# EAGLE schematic maho-dio (EAGLE 4.16)

## Sheet 1 of 2
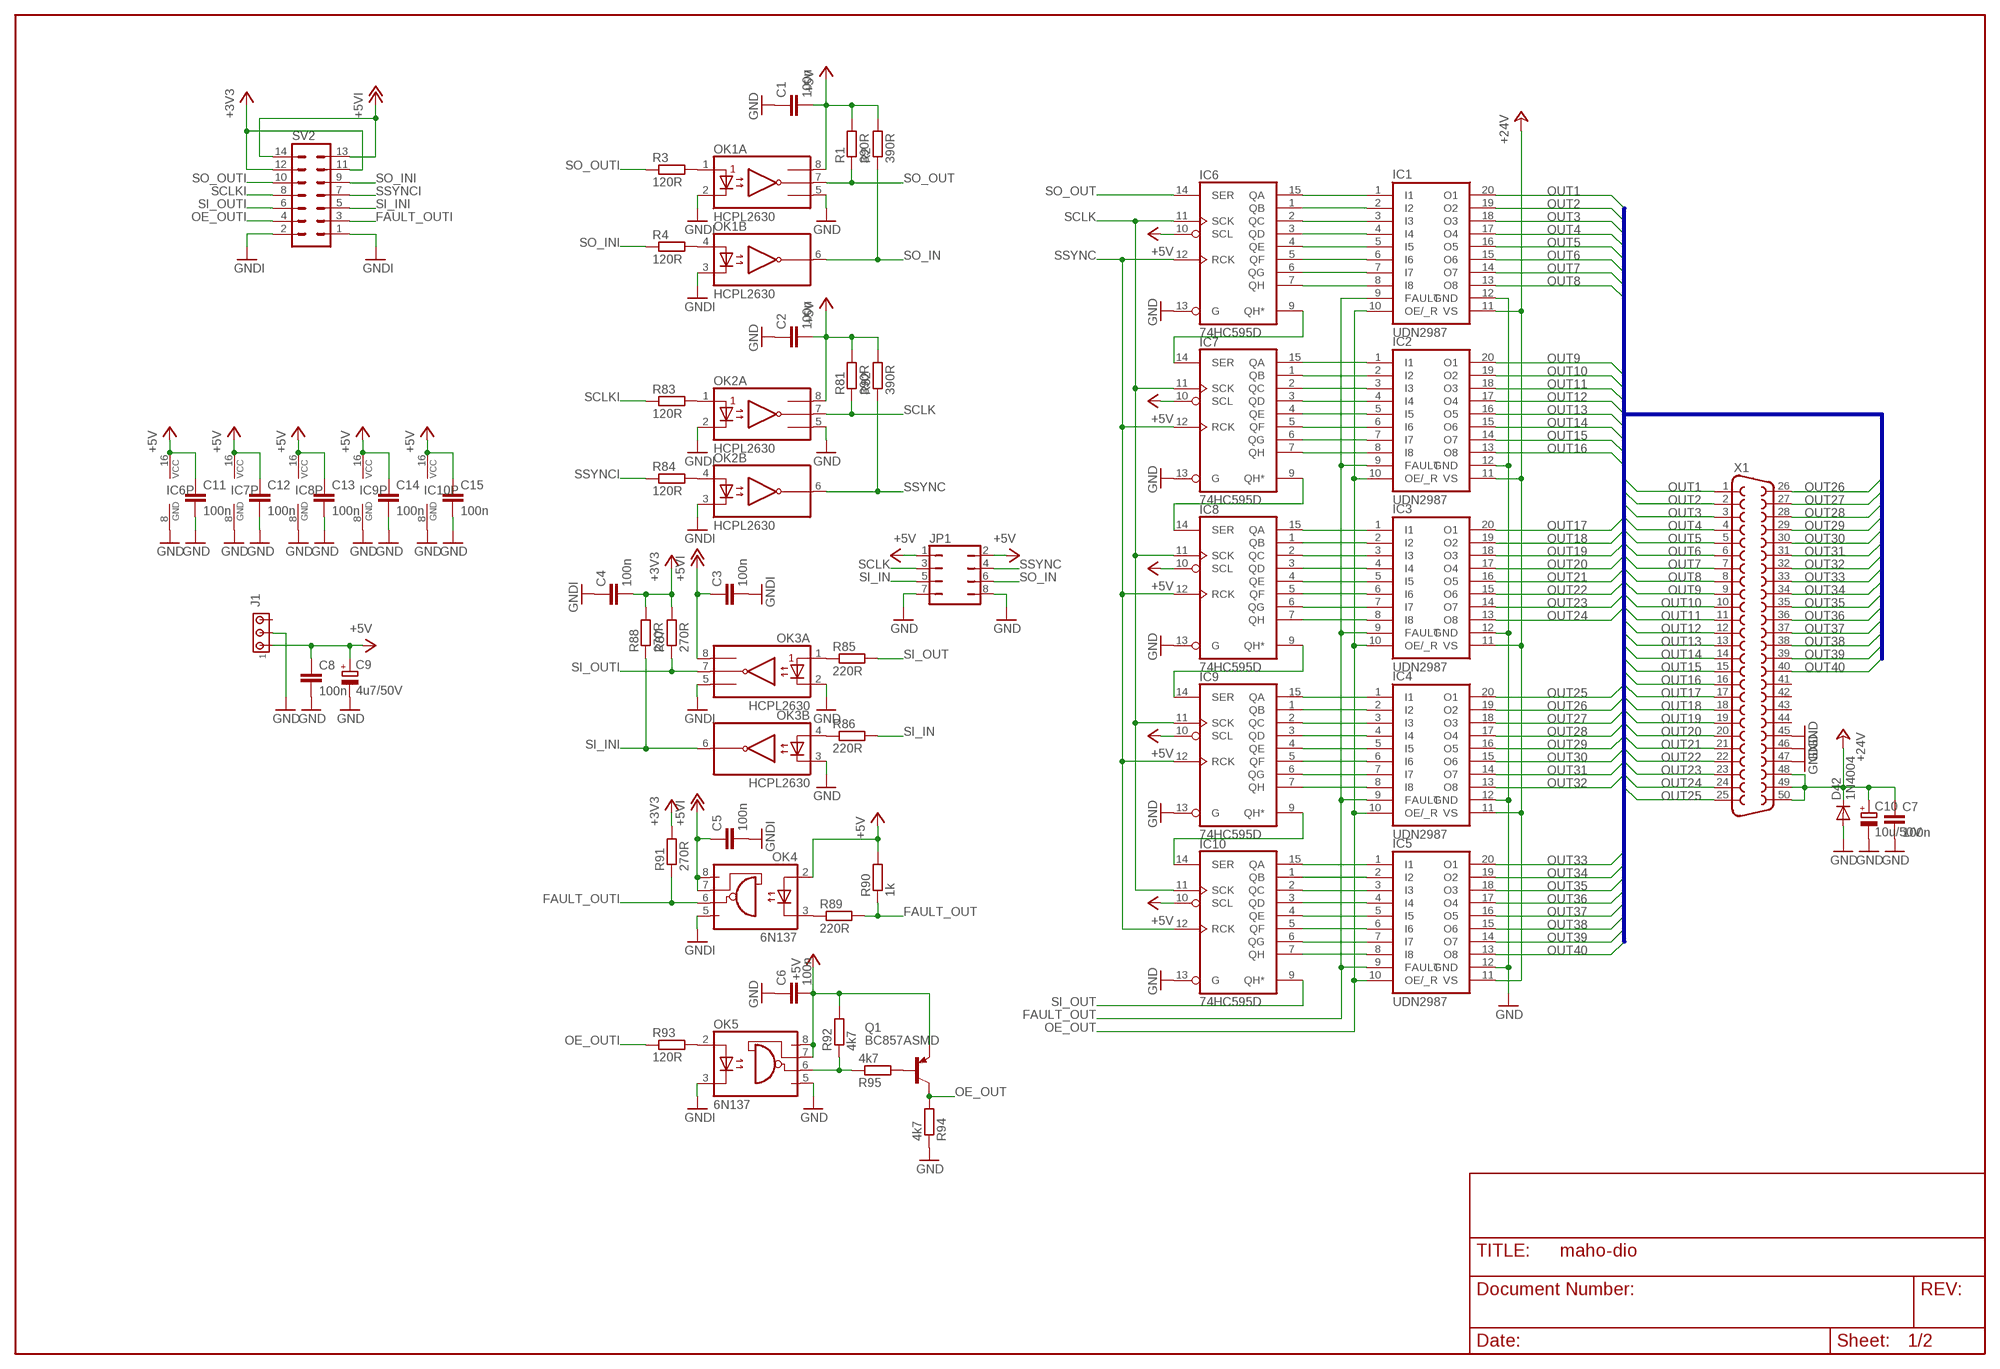
[diagram p0: schematic, sheet 1]

### Parts
C1  100n  C-EUC0603  [C0603]
C2  100n  C-EUC0603  [C0603]
C3  100n  C-EUC0603  [C0603]
C4  100n  C-EUC0603  [C0603]
C5  100n  C-EUC0603  [C0603]
C6  100n  C-EUC0603  [C0603]
C7  100n  C-EUC0603  [C0603]
C8  100n  C-EUC0603  [C0603]
C9  4u7/50V  CPOL-EUE2.5-5  [E2,5-5]
C10  10u/50V  CPOL-EUE2.5-5  [E2,5-5]
C11  100n  C-EUC0603  [C0603]
C12  100n  C-EUC0603  [C0603]
C13  100n  C-EUC0603  [C0603]
C14  100n  C-EUC0603  [C0603]
C15  100n  C-EUC0603  [C0603]
D42  1N4004  [DO41-10]
IC1  UDN2987  [DIL20]
IC2  UDN2987  [DIL20]
IC3  UDN2987  [DIL20]
IC4  UDN2987  [DIL20]
IC5  UDN2987  [DIL20]
IC6  74HC595D  [SO16]
IC7  74HC595D  [SO16]
IC8  74HC595D  [SO16]
IC9  74HC595D  [SO16]
IC10  74HC595D  [SO16]
J1  MTA03-100  [10X03MTA]
JP1  JP4Q  [JP4Q]
OK1  HCPL2630  [DIL08]
OK2  HCPL2630  [DIL08]
OK3  HCPL2630  [DIL08]
OK4  6N137  [DIL08]
OK5  6N137  [DIL08]
Q1  BC857ASMD  [SOT23-BEC]
R1  390R  R-EU_R0805  [R0805]
R2  390R  R-EU_R0805  [R0805]
R3  120R  R-EU_R0805  [R0805]
R4  120R  R-EU_R0805  [R0805]
R81  390R  R-EU_R0805  [R0805]
R82  390R  R-EU_R0805  [R0805]
R83  120R  R-EU_R0805  [R0805]
R84  120R  R-EU_R0805  [R0805]
R85  220R  R-EU_R0805  [R0805]
R86  220R  R-EU_R0805  [R0805]
R87  270R  R-EU_R0805  [R0805]
R88  270R  R-EU_R0805  [R0805]
R89  220R  R-EU_R0805  [R0805]
R90  1k  R-EU_R0805  [R0805]
R91  270R  R-EU_R0805  [R0805]
R92  4k7  R-EU_R0805  [R0805]
R93  120R  R-EU_R0805  [R0805]
R94  4k7  R-EU_R0805  [R0805]
R95  4k7  R-EU_R0805  [R0805]
SV2  ML14  [ML14]
X1  F50HP  [F50HP]

### Nets
+3V3: C4.2 R87.2 R88.2 R91.2 SV2.11 SV2.12
+5V: C1.2 C2.2 C6.2 C8.1 C9.+ C11.1 C12.1 C13.1 C14.1 C15.1 IC6.10(SCL) IC6.16(VCC) IC7.10(SCL) IC7.16(VCC) IC8.10(SCL) IC8.16(VCC) IC9.10(SCL) IC9.16(VCC) IC10.10(SCL) IC10.16(VCC) J1.1 JP1.1 JP1.2 OK1.8(A:VCC) OK2.8(A:VCC) OK4.2(A) OK5.7(VE) OK5.8(VCC) Q1.E R1.2 R2.2 R81.2 R82.2 R90.2 R92.2 ; also sheet 2
+12V: C3.1 C5.1 OK3.8(A:VCC) OK4.7(VE) OK4.8(VCC) SV2.13 SV2.14 ; supply symbol labelled +5VI
+24V: C7.1 C10.+ D42.C IC1.11(VS) IC2.11(VS) IC3.11(VS) IC4.11(VS) IC5.11(VS) X1.48 X1.49 X1.50
FAULT_OUT: IC1.9(FAULT) IC2.9(FAULT) IC3.9(FAULT) IC4.9(FAULT) IC5.9(FAULT) R89.2 R90.1
FAULT_OUTI: OK4.6(VO) R91.1 SV2.3
GND: C1.1 C2.1 C6.1 C7.2 C8.2 C9.- C10.- C11.2 C12.2 C13.2 C14.2 C15.2 D42.A IC1.12(GND) IC2.12(GND) IC3.12(GND) IC4.12(GND) IC5.12(GND) IC6.8(GND) IC6.13(G) IC7.8(GND) IC7.13(G) IC8.8(GND) IC8.13(G) IC9.8(GND) IC9.13(G) IC10.8(GND) IC10.13(G) J1.2 JP1.7 JP1.8 OK1.5(A:GND) OK2.5(A:GND) OK3.2(A:C1) OK3.3(B:C2) OK5.5(GND) R94.1 X1.45 X1.46 X1.47 ; also sheet 2
GNDI: C3.2 C4.1 C5.2 OK1.2(A:C1) OK1.3(B:C2) OK2.2(A:C1) OK2.3(B:C2) OK3.5(A:GND) OK4.5(GND) OK5.3(C) SV2.1 SV2.2
N$1: IC1.1(I1) IC6.15(QA)
N$2: IC1.2(I2) IC6.1(QB)
N$3: IC1.3(I3) IC6.2(QC)
N$4: IC1.4(I4) IC6.3(QD)
N$5: IC1.5(I5) IC6.4(QE)
N$6: IC1.6(I6) IC6.5(QF)
N$7: IC1.7(I7) IC6.6(QG)
N$8: IC1.8(I8) IC6.7(QH)
N$9: IC2.1(I1) IC7.15(QA)
N$10: IC2.2(I2) IC7.1(QB)
N$11: IC2.3(I3) IC7.2(QC)
N$12: IC2.4(I4) IC7.3(QD)
N$13: IC2.5(I5) IC7.4(QE)
N$14: IC2.6(I6) IC7.5(QF)
N$15: IC2.7(I7) IC7.6(QG)
N$16: IC2.8(I8) IC7.7(QH)
N$17: IC3.1(I1) IC8.15(QA)
N$18: IC3.2(I2) IC8.1(QB)
N$19: IC3.3(I3) IC8.2(QC)
N$20: IC3.4(I4) IC8.3(QD)
N$21: IC3.5(I5) IC8.4(QE)
N$22: IC3.6(I6) IC8.5(QF)
N$23: IC3.7(I7) IC8.6(QG)
N$24: IC3.8(I8) IC8.7(QH)
N$25: IC4.1(I1) IC9.15(QA)
N$26: IC4.2(I2) IC9.1(QB)
N$27: IC4.3(I3) IC9.2(QC)
N$28: IC4.4(I4) IC9.3(QD)
N$29: IC4.5(I5) IC9.4(QE)
N$30: IC4.6(I6) IC9.5(QF)
N$31: IC4.7(I7) IC9.6(QG)
N$32: IC4.8(I8) IC9.7(QH)
N$33: IC5.1(I1) IC10.15(QA)
N$34: IC5.2(I2) IC10.1(QB)
N$35: IC5.3(I3) IC10.2(QC)
N$36: IC5.4(I4) IC10.3(QD)
N$37: IC5.5(I5) IC10.4(QE)
N$38: IC5.6(I6) IC10.5(QF)
N$39: IC5.7(I7) IC10.6(QG)
N$40: IC5.8(I8) IC10.7(QH)
N$41: OK3.1(A:A1) R85.1
N$42: OK3.4(B:A2) R86.1
N$43: IC6.9(QH*) IC7.14(SER)
N$44: IC7.9(QH*) IC8.14(SER)
N$45: IC8.9(QH*) IC9.14(SER)
N$46: IC9.9(QH*) IC10.14(SER)
N$47: OK1.1(A:A1) R3.2
N$48: OK1.4(B:A2) R4.2
N$49: OK2.1(A:A1) R83.2
N$134: OK2.4(B:A2) R84.2
N$136: Q1.B R95.2
N$137: OK5.6(VO) R92.1 R95.1
N$142: OK4.3(C) R89.1
N$144: OK5.2(A) R93.2
OE_OUT: IC1.10(OE/_R) IC2.10(OE/_R) IC3.10(OE/_R) IC4.10(OE/_R) IC5.10(OE/_R) Q1.C R94.2
OE_OUTI: R93.1 SV2.4
OUT1: IC1.20(O1) X1.1
OUT2: IC1.19(O2) X1.2
OUT3: IC1.18(O3) X1.3
OUT4: IC1.17(O4) X1.4
OUT5: IC1.16(O5) X1.5
OUT6: IC1.15(O6) X1.6
OUT7: IC1.14(O7) X1.7
OUT8: IC1.13(O8) X1.8
OUT9: IC2.20(O1) X1.9
OUT10: IC2.19(O2) X1.10
OUT11: IC2.18(O3) X1.11
OUT12: IC2.17(O4) X1.12
OUT13: IC2.16(O5) X1.13
OUT14: IC2.15(O6) X1.14
OUT15: IC2.14(O7) X1.15
OUT16: IC2.13(O8) X1.16
OUT17: IC3.20(O1) X1.17
OUT18: IC3.19(O2) X1.18
OUT19: IC3.18(O3) X1.19
OUT20: IC3.17(O4) X1.20
OUT21: IC3.16(O5) X1.21
OUT22: IC3.15(O6) X1.22
OUT23: IC3.14(O7) X1.23
OUT24: IC3.13(O8) X1.24
OUT25: IC4.20(O1) X1.25
OUT26: IC4.19(O2) X1.26
OUT27: IC4.18(O3) X1.27
OUT28: IC4.17(O4) X1.28
OUT29: IC4.16(O5) X1.29
OUT30: IC4.15(O6) X1.30
OUT31: IC4.14(O7) X1.31
OUT32: IC4.13(O8) X1.32
OUT33: IC5.20(O1) X1.33
OUT34: IC5.19(O2) X1.34
OUT35: IC5.18(O3) X1.35
OUT36: IC5.17(O4) X1.36
OUT37: IC5.16(O5) X1.37
OUT38: IC5.15(O6) X1.38
OUT39: IC5.14(O7) X1.39
OUT40: IC5.13(O8) X1.40
SCLK: IC6.11(SCK) IC7.11(SCK) IC8.11(SCK) IC9.11(SCK) IC10.11(SCK) JP1.3 OK2.7(A:VO1) R81.1 ; also sheet 2
SCLKI: R83.1 SV2.8
SI_IN: JP1.5 R86.2 ; also sheet 2
SI_INI: OK3.6(B:VO2) R88.1 SV2.5
SI_OUT: IC10.9(QH*) R85.2
SI_OUTI: OK3.7(A:VO1) R87.1 SV2.6
SO_IN: JP1.6 OK1.6(B:VO2) R2.1 ; also sheet 2
SO_INI: R4.1 SV2.9
SO_OUT: IC6.14(SER) OK1.7(A:VO1) R1.1
SO_OUTI: R3.1 SV2.10
SSYNC: IC6.12(RCK) IC7.12(RCK) IC8.12(RCK) IC9.12(RCK) IC10.12(RCK) JP1.4 OK2.6(B:VO2) R82.1 ; also sheet 2
SSYNCI: R84.1 SV2.7
Unconnected: J1.3 X1.41 X1.42 X1.43 X1.44

### Buses
OUT[1..40]

## Sheet 2 of 2
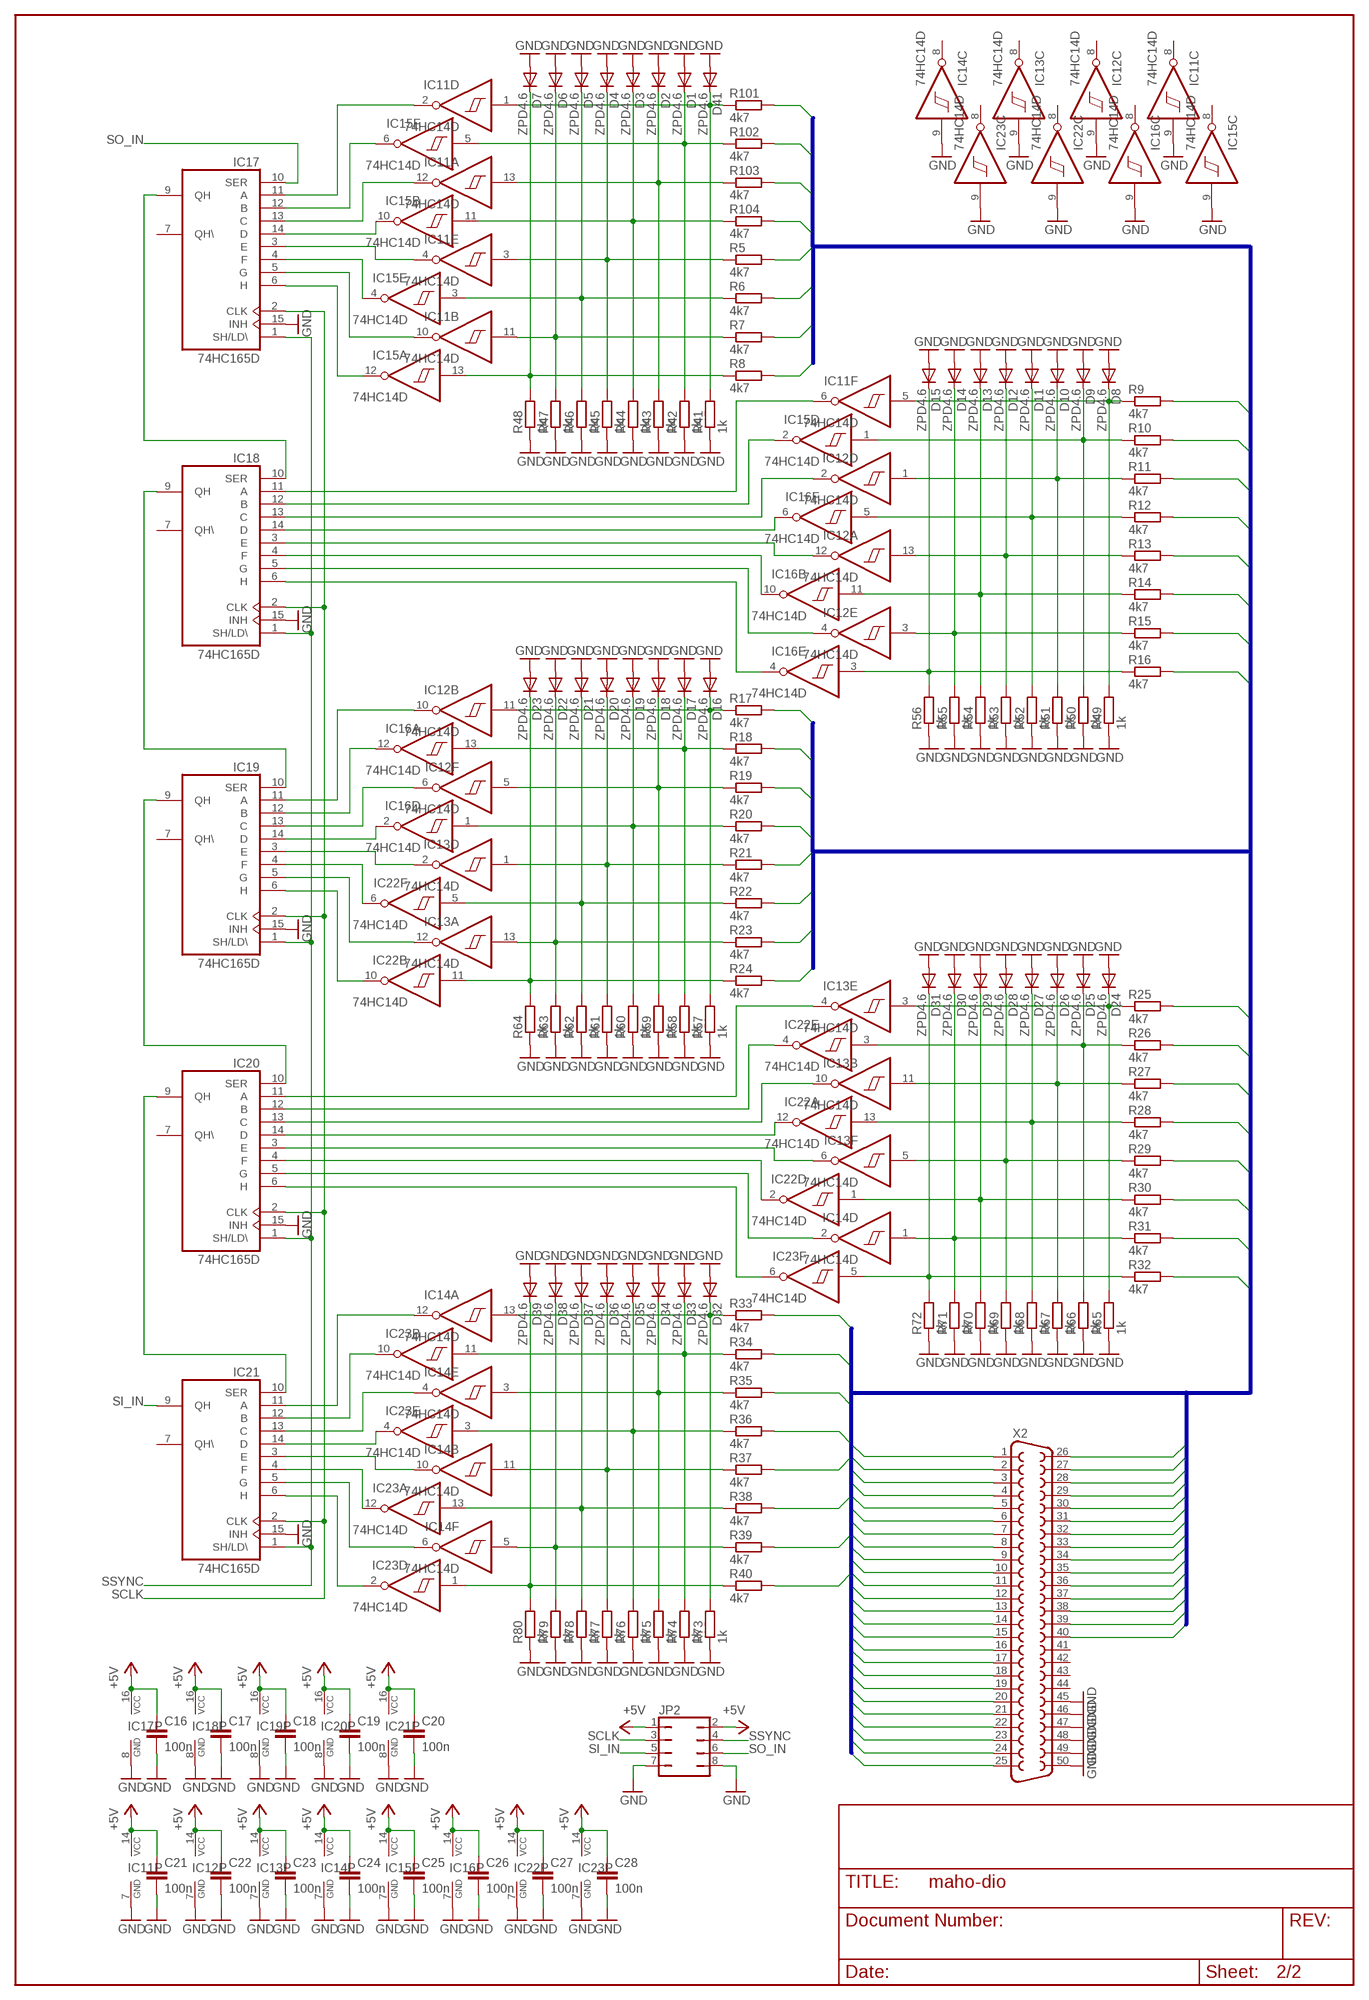
[diagram p1: schematic, sheet 2]

### Parts
C16  100n  C-EUC0603  [C0603]
C17  100n  C-EUC0603  [C0603]
C18  100n  C-EUC0603  [C0603]
C19  100n  C-EUC0603  [C0603]
C20  100n  C-EUC0603  [C0603]
C21  100n  C-EUC0603  [C0603]
C22  100n  C-EUC0603  [C0603]
C23  100n  C-EUC0603  [C0603]
C24  100n  C-EUC0603  [C0603]
C25  100n  C-EUC0603  [C0603]
C26  100n  C-EUC0603  [C0603]
C27  100n  C-EUC0603  [C0603]
C28  100n  C-EUC0603  [C0603]
D1  ZPD4.6  DIODE-MINIMELF  [MINIMELF]
D2  ZPD4.6  DIODE-MINIMELF  [MINIMELF]
D3  ZPD4.6  DIODE-MINIMELF  [MINIMELF]
D4  ZPD4.6  DIODE-MINIMELF  [MINIMELF]
D5  ZPD4.6  DIODE-MINIMELF  [MINIMELF]
D6  ZPD4.6  DIODE-MINIMELF  [MINIMELF]
D7  ZPD4.6  DIODE-MINIMELF  [MINIMELF]
D8  ZPD4.6  DIODE-MINIMELF  [MINIMELF]
D9  ZPD4.6  DIODE-MINIMELF  [MINIMELF]
D10  ZPD4.6  DIODE-MINIMELF  [MINIMELF]
D11  ZPD4.6  DIODE-MINIMELF  [MINIMELF]
D12  ZPD4.6  DIODE-MINIMELF  [MINIMELF]
D13  ZPD4.6  DIODE-MINIMELF  [MINIMELF]
D14  ZPD4.6  DIODE-MINIMELF  [MINIMELF]
D15  ZPD4.6  DIODE-MINIMELF  [MINIMELF]
D16  ZPD4.6  DIODE-MINIMELF  [MINIMELF]
D17  ZPD4.6  DIODE-MINIMELF  [MINIMELF]
D18  ZPD4.6  DIODE-MINIMELF  [MINIMELF]
D19  ZPD4.6  DIODE-MINIMELF  [MINIMELF]
D20  ZPD4.6  DIODE-MINIMELF  [MINIMELF]
D21  ZPD4.6  DIODE-MINIMELF  [MINIMELF]
D22  ZPD4.6  DIODE-MINIMELF  [MINIMELF]
D23  ZPD4.6  DIODE-MINIMELF  [MINIMELF]
D24  ZPD4.6  DIODE-MINIMELF  [MINIMELF]
D25  ZPD4.6  DIODE-MINIMELF  [MINIMELF]
D26  ZPD4.6  DIODE-MINIMELF  [MINIMELF]
D27  ZPD4.6  DIODE-MINIMELF  [MINIMELF]
D28  ZPD4.6  DIODE-MINIMELF  [MINIMELF]
D29  ZPD4.6  DIODE-MINIMELF  [MINIMELF]
D30  ZPD4.6  DIODE-MINIMELF  [MINIMELF]
D31  ZPD4.6  DIODE-MINIMELF  [MINIMELF]
D32  ZPD4.6  DIODE-MINIMELF  [MINIMELF]
D33  ZPD4.6  DIODE-MINIMELF  [MINIMELF]
D34  ZPD4.6  DIODE-MINIMELF  [MINIMELF]
D35  ZPD4.6  DIODE-MINIMELF  [MINIMELF]
D36  ZPD4.6  DIODE-MINIMELF  [MINIMELF]
D37  ZPD4.6  DIODE-MINIMELF  [MINIMELF]
D38  ZPD4.6  DIODE-MINIMELF  [MINIMELF]
D39  ZPD4.6  DIODE-MINIMELF  [MINIMELF]
D41  ZPD4.6  DIODE-MINIMELF  [MINIMELF]
IC11  74HC14D  [SO14]
IC12  74HC14D  [SO14]
IC13  74HC14D  [SO14]
IC14  74HC14D  [SO14]
IC15  74HC14D  [SO14]
IC16  74HC14D  [SO14]
IC17  74HC165D  [SO16]
IC18  74HC165D  [SO16]
IC19  74HC165D  [SO16]
IC20  74HC165D  [SO16]
IC21  74HC165D  [SO16]
IC22  74HC14D  [SO14]
IC23  74HC14D  [SO14]
JP2  JP4Q  [JP4Q]
R5  4k7  R-EU_R0805  [R0805]
R6  4k7  R-EU_R0805  [R0805]
R7  4k7  R-EU_R0805  [R0805]
R8  4k7  R-EU_R0805  [R0805]
R9  4k7  R-EU_R0805  [R0805]
R10  4k7  R-EU_R0805  [R0805]
R11  4k7  R-EU_R0805  [R0805]
R12  4k7  R-EU_R0805  [R0805]
R13  4k7  R-EU_R0805  [R0805]
R14  4k7  R-EU_R0805  [R0805]
R15  4k7  R-EU_R0805  [R0805]
R16  4k7  R-EU_R0805  [R0805]
R17  4k7  R-EU_R0805  [R0805]
R18  4k7  R-EU_R0805  [R0805]
R19  4k7  R-EU_R0805  [R0805]
R20  4k7  R-EU_R0805  [R0805]
R21  4k7  R-EU_R0805  [R0805]
R22  4k7  R-EU_R0805  [R0805]
R23  4k7  R-EU_R0805  [R0805]
R24  4k7  R-EU_R0805  [R0805]
R25  4k7  R-EU_R0805  [R0805]
R26  4k7  R-EU_R0805  [R0805]
R27  4k7  R-EU_R0805  [R0805]
R28  4k7  R-EU_R0805  [R0805]
R29  4k7  R-EU_R0805  [R0805]
R30  4k7  R-EU_R0805  [R0805]
R31  4k7  R-EU_R0805  [R0805]
R32  4k7  R-EU_R0805  [R0805]
R33  4k7  R-EU_R0805  [R0805]
R34  4k7  R-EU_R0805  [R0805]
R35  4k7  R-EU_R0805  [R0805]
R36  4k7  R-EU_R0805  [R0805]
R37  4k7  R-EU_R0805  [R0805]
R38  4k7  R-EU_R0805  [R0805]
R39  4k7  R-EU_R0805  [R0805]
R40  4k7  R-EU_R0805  [R0805]
R41  1k  R-EU_R0805  [R0805]
R42  1k  R-EU_R0805  [R0805]
R43  1k  R-EU_R0805  [R0805]
R44  1k  R-EU_R0805  [R0805]
R45  1k  R-EU_R0805  [R0805]
R46  1k  R-EU_R0805  [R0805]
R47  1k  R-EU_R0805  [R0805]
R48  1k  R-EU_R0805  [R0805]
R49  1k  R-EU_R0805  [R0805]
R50  1k  R-EU_R0805  [R0805]
R51  1k  R-EU_R0805  [R0805]
R52  1k  R-EU_R0805  [R0805]
R53  1k  R-EU_R0805  [R0805]
R54  1k  R-EU_R0805  [R0805]
R55  1k  R-EU_R0805  [R0805]
R56  1k  R-EU_R0805  [R0805]
R57  1k  R-EU_R0805  [R0805]
R58  1k  R-EU_R0805  [R0805]
R59  1k  R-EU_R0805  [R0805]
R60  1k  R-EU_R0805  [R0805]
R61  1k  R-EU_R0805  [R0805]
R62  1k  R-EU_R0805  [R0805]
R63  1k  R-EU_R0805  [R0805]
R64  1k  R-EU_R0805  [R0805]
R65  1k  R-EU_R0805  [R0805]
R66  1k  R-EU_R0805  [R0805]
R67  1k  R-EU_R0805  [R0805]
R68  1k  R-EU_R0805  [R0805]
R69  1k  R-EU_R0805  [R0805]
R70  1k  R-EU_R0805  [R0805]
R71  1k  R-EU_R0805  [R0805]
R72  1k  R-EU_R0805  [R0805]
R73  1k  R-EU_R0805  [R0805]
R74  1k  R-EU_R0805  [R0805]
R75  1k  R-EU_R0805  [R0805]
R76  1k  R-EU_R0805  [R0805]
R77  1k  R-EU_R0805  [R0805]
R78  1k  R-EU_R0805  [R0805]
R79  1k  R-EU_R0805  [R0805]
R80  1k  R-EU_R0805  [R0805]
R101  4k7  R-EU_R0805  [R0805]
R102  4k7  R-EU_R0805  [R0805]
R103  4k7  R-EU_R0805  [R0805]
R104  4k7  R-EU_R0805  [R0805]
X2  F50HP  [F50HP]

### Nets
+5V: C16.1 C17.1 C18.1 C19.1 C20.1 C21.1 C22.1 C23.1 C24.1 C25.1 C26.1 C27.1 C28.1 IC11.14(P:VCC) IC12.14(P:VCC) IC13.14(P:VCC) IC14.14(P:VCC) IC15.14(P:VCC) IC16.14(P:VCC) IC17.16(VCC) IC18.16(VCC) IC19.16(VCC) IC20.16(VCC) IC21.16(VCC) IC22.14(P:VCC) IC23.14(P:VCC) JP2.1 JP2.2 ; also sheet 1
GND: C16.2 C17.2 C18.2 C19.2 C20.2 C21.2 C22.2 C23.2 C24.2 C25.2 C26.2 C27.2 C28.2 D1.A D2.A D3.A D4.A D5.A D6.A D7.A D8.A D9.A D10.A D11.A D12.A D13.A D14.A D15.A D16.A D17.A D18.A D19.A D20.A D21.A D22.A D23.A D24.A D25.A D26.A D27.A D28.A D29.A D30.A D31.A D32.A D33.A D34.A D35.A D36.A D37.A D38.A D39.A D41.A IC11.7(P:GND) IC11.9(C:I) IC12.7(P:GND) IC12.9(C:I) IC13.7(P:GND) IC13.9(C:I) IC14.7(P:GND) IC14.9(C:I) IC15.7(P:GND) IC15.9(C:I) IC16.7(P:GND) IC16.9(C:I) IC17.8(GND) IC17.15(INH) IC18.8(GND) IC18.15(INH) IC19.8(GND) IC19.15(INH) IC20.8(GND) IC20.15(INH) IC21.8(GND) IC21.15(INH) IC22.7(P:GND) IC22.9(C:I) IC23.7(P:GND) IC23.9(C:I) JP2.7 JP2.8 R41.1 R42.1 R43.1 R44.1 R45.1 R46.1 R47.1 R48.1 R49.1 R50.1 R51.1 R52.1 R53.1 R54.1 R55.1 R56.1 R57.1 R58.1 R59.1 R60.1 R61.1 R62.1 R63.1 R64.1 R65.1 R66.1 R67.1 R68.1 R69.1 R70.1 R71.1 R72.1 R73.1 R74.1 R75.1 R76.1 R77.1 R78.1 R79.1 R80.1 X2.45 X2.46 X2.47 X2.48 X2.49 X2.50 ; also sheet 1
IN1: R101.2 X2.1
IN2: R102.2 X2.2
IN3: R103.2 X2.3
IN4: R104.2 X2.4
IN5: R5.2 X2.5
IN6: R6.2 X2.6
IN7: R7.2 X2.7
IN8: R8.2 X2.8
IN9: R9.2 X2.9
IN10: R10.2 X2.10
IN11: R11.2 X2.11
IN12: R12.2 X2.12
IN13: R13.2 X2.13
IN14: R14.2 X2.14
IN15: R15.2 X2.15
IN16: R16.2 X2.16
IN17: R17.2 X2.17
IN18: R18.2 X2.18
IN19: R19.2 X2.19
IN20: R20.2 X2.20
IN21: R21.2 X2.21
IN22: R22.2 X2.22
IN23: R23.2 X2.23
IN24: R24.2 X2.24
IN25: R25.2 X2.25
IN26: R26.2 X2.26
IN27: R27.2 X2.27
IN28: R28.2 X2.28
IN29: R29.2 X2.29
IN30: R30.2 X2.30
IN31: R31.2 X2.31
IN32: R32.2 X2.32
IN33: R33.2 X2.33
IN34: R34.2 X2.34
IN35: R35.2 X2.35
IN36: R36.2 X2.36
IN37: R37.2 X2.37
IN38: R38.2 X2.38
IN39: R39.2 X2.39
IN40: R40.2 X2.40
N$50: D41.C IC11.1(D:I) R41.2 R101.1
N$51: D1.C IC15.5(F:I) R42.2 R102.1
N$52: D2.C IC11.13(A:I) R43.2 R103.1
N$53: D3.C IC15.11(B:I) R44.2 R104.1
N$54: D4.C IC11.3(E:I) R5.1 R45.2
N$55: D5.C IC15.3(E:I) R6.1 R46.2
N$56: D6.C IC11.11(B:I) R7.1 R47.2
N$57: D7.C IC15.13(A:I) R8.1 R48.2
N$58: IC11.2(D:O) IC17.11(A)
N$59: IC15.6(F:O) IC17.12(B)
N$60: IC11.12(A:O) IC17.13(C)
N$61: IC15.10(B:O) IC17.14(D)
N$62: IC11.4(E:O) IC17.3(E)
N$63: IC15.4(E:O) IC17.4(F)
N$64: IC11.10(B:O) IC17.5(G)
N$65: IC15.12(A:O) IC17.6(H)
N$66: D8.C IC11.5(F:I) R9.1 R49.2
N$67: D9.C IC15.1(D:I) R10.1 R50.2
N$68: D10.C IC12.1(D:I) R11.1 R51.2
N$69: D11.C IC16.5(F:I) R12.1 R52.2
N$70: D12.C IC12.13(A:I) R13.1 R53.2
N$71: D13.C IC16.11(B:I) R14.1 R54.2
N$72: D14.C IC12.3(E:I) R15.1 R55.2
N$73: D15.C IC16.3(E:I) R16.1 R56.2
N$74: IC11.6(F:O) IC18.11(A)
N$75: IC15.2(D:O) IC18.12(B)
N$76: IC12.2(D:O) IC18.13(C)
N$77: IC16.6(F:O) IC18.14(D)
N$78: IC12.12(A:O) IC18.3(E)
N$79: IC16.10(B:O) IC18.4(F)
N$80: IC12.4(E:O) IC18.5(G)
N$81: IC16.4(E:O) IC18.6(H)
N$82: D16.C IC12.11(B:I) R17.1 R57.2
N$83: D17.C IC16.13(A:I) R18.1 R58.2
N$84: D18.C IC12.5(F:I) R19.1 R59.2
N$85: D19.C IC16.1(D:I) R20.1 R60.2
N$86: D20.C IC13.1(D:I) R21.1 R61.2
N$87: D21.C IC22.5(F:I) R22.1 R62.2
N$88: D22.C IC13.13(A:I) R23.1 R63.2
N$89: D23.C IC22.11(B:I) R24.1 R64.2
N$90: IC12.10(B:O) IC19.11(A)
N$91: IC16.12(A:O) IC19.12(B)
N$92: IC12.6(F:O) IC19.13(C)
N$93: IC16.2(D:O) IC19.14(D)
N$94: IC13.2(D:O) IC19.3(E)
N$95: IC19.4(F) IC22.6(F:O)
N$96: IC13.12(A:O) IC19.5(G)
N$97: IC19.6(H) IC22.10(B:O)
N$98: D24.C IC13.3(E:I) R25.1 R65.2
N$99: D25.C IC22.3(E:I) R26.1 R66.2
N$100: D26.C IC13.11(B:I) R27.1 R67.2
N$101: D27.C IC22.13(A:I) R28.1 R68.2
N$102: D28.C IC13.5(F:I) R29.1 R69.2
N$103: D29.C IC22.1(D:I) R30.1 R70.2
N$104: D30.C IC14.1(D:I) R31.1 R71.2
N$105: D31.C IC23.5(F:I) R32.1 R72.2
N$106: IC13.4(E:O) IC20.11(A)
N$107: IC20.12(B) IC22.4(E:O)
N$108: IC13.10(B:O) IC20.13(C)
N$109: IC20.14(D) IC22.12(A:O)
N$110: IC13.6(F:O) IC20.3(E)
N$111: IC20.4(F) IC22.2(D:O)
N$112: IC14.2(D:O) IC20.5(G)
N$113: IC20.6(H) IC23.6(F:O)
N$114: D32.C IC14.13(A:I) R33.1 R73.2
N$115: D33.C IC23.11(B:I) R34.1 R74.2
N$116: D34.C IC14.3(E:I) R35.1 R75.2
N$117: D35.C IC23.3(E:I) R36.1 R76.2
N$118: D36.C IC14.11(B:I) R37.1 R77.2
N$119: D37.C IC23.13(A:I) R38.1 R78.2
N$120: D38.C IC14.5(F:I) R39.1 R79.2
N$121: D39.C IC23.1(D:I) R40.1 R80.2
N$122: IC14.12(A:O) IC21.11(A)
N$123: IC21.12(B) IC23.10(B:O)
N$124: IC14.4(E:O) IC21.13(C)
N$125: IC21.14(D) IC23.4(E:O)
N$126: IC14.10(B:O) IC21.3(E)
N$127: IC21.4(F) IC23.12(A:O)
N$128: IC14.6(F:O) IC21.5(G)
N$129: IC21.6(H) IC23.2(D:O)
N$130: IC17.9(QH) IC18.10(SER)
N$131: IC18.9(QH) IC19.10(SER)
N$132: IC19.9(QH) IC20.10(SER)
N$133: IC20.9(QH) IC21.10(SER)
SCLK: IC17.2(CLK) IC18.2(CLK) IC19.2(CLK) IC20.2(CLK) IC21.2(CLK) JP2.3 ; also sheet 1
SI_IN: IC21.9(QH) JP2.5 ; also sheet 1
SO_IN: IC17.10(SER) JP2.6 ; also sheet 1
SSYNC: IC17.1(SH/LD\) IC18.1(SH/LD\) IC19.1(SH/LD\) IC20.1(SH/LD\) IC21.1(SH/LD\) JP2.4 ; also sheet 1
Unconnected: IC11.8(C:O) IC12.8(C:O) IC13.8(C:O) IC14.8(C:O) IC15.8(C:O) IC16.8(C:O) IC17.7(QH\) IC18.7(QH\) IC19.7(QH\) IC20.7(QH\) IC21.7(QH\) IC22.8(C:O) IC23.8(C:O) X2.41 X2.42 X2.43 X2.44

### Buses
IN[1..40]

## Library data of the parts
C1-C8 C11-C28 = rcl:C-EU: CAPACITOR, European symbol
C9 C10 = rcl:CPOL-EU: POLARIZED CAPACITOR, European symbol
D1-D39 D41 = diode:DIODE-: DIODE
D42 = diode:1N4004: DIODE general purpose rectifier, 1 A
IC1-IC5 = sascha_misc:UDN2987
IC6-IC10 = 74xx-eu:74*595: 8-bit SHIFT REGISTER, output latch
IC11-IC16 IC22 IC23 = 74xx-eu:74*14: Hex schmitt trigger INVERTER
IC17-IC21 = 74xx-eu:74*165: 8-bit parallel load SHIFT REGISTER
J1 = con-amp:MTA03-100: AMP connector
JP1 JP2 = jumper:JP4Q: JUMPER
OK1-OK3 = optocoupler:HCPL2630: HEWLETT PACKARD OPTO COUPLER
OK4 OK5 = optocoupler:6N137: MOTOROLA OPTO COUPLER
Q1 = transistor-pnp:BC857*: PNP Transistror
R1-R95 R101-R104 = rcl:R-EU_: RESISTOR, European symbol
SV2 = con-harting-ml:ML14: HARTING
X1 X2 = con-subd:F50: SUB-D